# Altium project SOMA_25042022.PrjPcb (part 1 of 2)
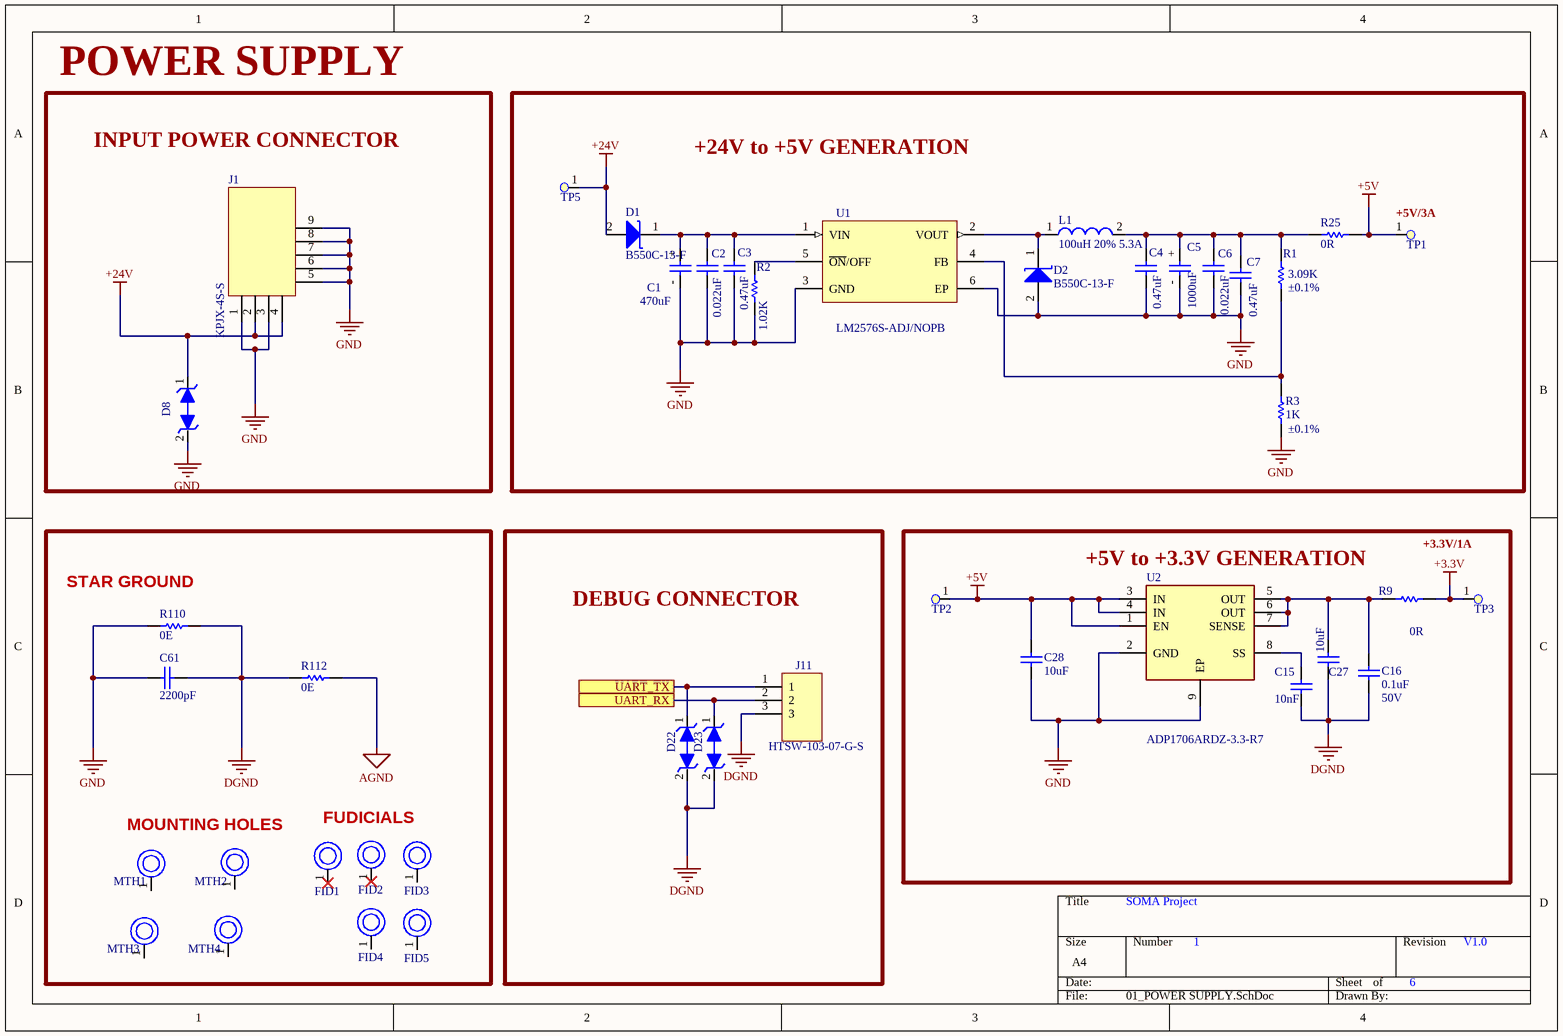
[diagram p0: 01_POWER SUPPLY.SchDoc]
DOC_ID: PRJ/2020/02
6 sheets, 293 parts. Net scope: flat (ports and power ports of the same name join across sheets).
Board file: My_SOMA_25042022.PcbDoc
Sheets:
  01_POWER SUPPLY.SchDoc
  02_SPEAKER & LED STRIPS.SchDoc
  03_CONNECTORS & AUDIO CONTROL INPUTS.SchDoc
  04_BLE & WIFI module.SchDoc
  05_MCU1.SchDoc
  06_ACCELEROMETER.SchDoc

## Sheet 01_POWER SUPPLY.SchDoc: SOMA Project
size A4; Revision: V1.0; SheetNumber: 1

### Parts
C1  value 470uF  [CAPAE1700X1650N]  (hidden comment: CAP ALUM 470UF 20% 63V SMD)
C2  value 0.022uF  [C0603]  (hidden comment: CAP CER 0.022UF 100V X7R 0603)
C3  value 0.47uF  [C1206]  (hidden comment: CAP CER 0.47UF 100V X7R 1206)
C4  value 0.47uF  [C1206]  (hidden comment: CAP CER 0.47UF 100V X7R 1206)
C5  value 1000uF  [CAPAE1300X1350N]  (hidden comment: CAP ALUM 1000UF 20% 25V SMD)
C6  value 0.022uF  [C0603]  (hidden comment: CAP CER 0.022UF 100V X7R 0603)
C7  value 0.47uF  [C1206]  (hidden comment: CAP CER 0.47UF 100V X7R 1206)
C15  value 10nF  [C0603]  (hidden comment: CAP CER 0603 10NF 25VDC X8G)
C16  Rating: 50V  [C0402]  (hidden comment: 0.1uF)
C27  value 10uF  [C0603]  (hidden comment: CAP CER 10UF 25V X5R 0603)
C28  value 10uF  [C0603]  (hidden comment: CAP CER 10UF 25V X5R 0603)
C61  value 2200pF  [C1206]  (hidden comment: CAP CER 2200PF 1.5KV X7R 1206)
D1  DIODE SCHOTTKY 50V 5A SMC  [SOD8060X250N_2A]  (value not drawn)
D2  DIODE SCHOTTKY 50V 5A SMC  [SOD8060X250N_2A]  (value not drawn)
D8  TVS DIODE 24VWM 38.9VC SMC  [SOD8060X260N_BI]  (value not drawn)
D22  TVS DIODE 3.3VWM 11.5VC SOD923  [SOD1006X40N_BI]  (value not drawn)
D23  TVS DIODE 3.3VWM 11.5VC SOD923  [SOD1006X40N_BI]  (value not drawn)
FID1  M3  [FIDUCIAL_40C]  (value not drawn)
FID2  M3  [FIDUCIAL_40C]  (value not drawn)
FID3  M3  [FIDUCIAL_40C]  (value not drawn)
FID4  M3  [FIDUCIAL_40C]  (value not drawn)
FID5  M3  [FIDUCIAL_40C]  (value not drawn)
J1  value KPJX-4S-S  [KYCON_KPJX-4S -S]  (hidden comment: CONN JACK FMALE 4POS TIN SOLDER)
J11  value HTSW-103-07-G-S  [BERG_1X3]  (hidden comment: CONN HEADER VERT 3POS 2.54MM)
L1  value 100uH 20% 5.3A  [IND_MGV1707101M-10]  (hidden comment: FIXED IND 100UH 5.3A 118MOHM SMD)
MTH1  M3  [MH]  (value not drawn)
MTH2  M3  [MH]  (value not drawn)
MTH3  M3  [MH]  (value not drawn)
MTH4  M3  [MH]  (value not drawn)
R1  value 3.09K  Tolerance: ±0.1%  [R1206]  (hidden comment: RES SMD 3.09K OHM 0.1% 1/4W 1206)
R2  value 1.02K  [R1206]  (hidden comment: RES SMD 1.02K OHM 1% 1/4W 1206)
R3  value 1K  Tolerance: ±0.1%  [R0805]  (hidden comment: RES 1K OHM 0.1% 1/8W 0805)
R9  value 0R  [R1206]  (hidden comment: RES 0 OHM JUMPER 1/4W 1206)
R25  value 0R  [R1206]  (hidden comment: RES 0 OHM JUMPER 1/4W 1206)
R110  0E  [R0603]
R112  0E  [R0603]
TP1  Test Point,1.6mm Diameter,SMD  [TP_63C]  (value not drawn)  (no BOM)
TP2  Test Point,1.6mm Diameter,SMD  [TP_63C]  (value not drawn)  (no BOM)
TP3  Test Point,1.6mm Diameter,SMD  [TP_63C]  (value not drawn)  (no BOM)
TP5  Test Point,1.6mm Diameter,SMD  [TP_63C]  (value not drawn)  (no BOM)
U1  value LM2576S-ADJ/NOPB  [TO-263-6_LM2576S]  (hidden comment: IC REG BUCK ADJ 3A TO263-5)
U2  Manufacturer part Number: ADP1706ARDZ-3.3-R7  [SOIC127P600X170-9N]  (hidden comment: IC REG LINEAR 3.3V 1A 8SOIC)

### Blocks framed on the sheet
POWER SUPPLY: D8 J1
+24V to +5V GENERATION: C1-C7 D1 D2 L1 R1-R3 R25 TP1 TP5 U1
DEBUG CONNECTOR: D22 D23 J11
+5V to +3.3V GENERATION: C15 C16 C27 C28 R9 TP2 TP3 U2

### Ports
UART_RX, UART_TX

### Nets
+3.3V: R9.2 TP3.1
+5V: C28.2 R25.2 TP1.1 TP2.1 U2.1(EN) U2.3(IN) U2.4(IN)
+24V: D1.2(A) D8.1(K) J1.2 J1.4 TP5.1
AGND: R112.2
DGND: C15.1 C16.1 C27.1 C61.2 D22.2(A) D23.2(A) J11.3 R110.2 R112.1
GND: C1.- C2.2 C3.1 C4.1 C5.- C6.1 C7.2 C28.1 C61.1 D2.2(A) D8.2(A) J1.1 J1.3 J1.5 J1.6 J1.7 J1.8 J1.9 R2.1 R3.1 R110.1 U1.3(GND) U1.6(EP) U2.2(GND) U2.9(EP)
UART_RX: D23.1(K) J11.2 ; port UART_RX
UART_TX: D22.1(K) J11.1 ; port UART_TX
NetC1_+: C1.+ C2.1 C3.2 D1.1(K) U1.1(VIN)
NetC4_2: C4.2 C5.+ C6.2 C7.1 L1.2 R1.2 R25.1
NetC15_2: C15.2 U2.8(SS)
NetC16_2: C16.2 C27.2 R9.1 U2.5(OUT) U2.6(OUT) U2.7(SENSE)
NetD2_1: D2.1(K) L1.1 U1.2(VOUT)
NetR1_1: R1.1 R3.2 U1.4(FB)
NetR2_2: R2.2 U1.5(~{ON}/OFF)

Not connected (* = marked no-connect by the designer): FID1 1*; FID2 1*; FID3 1; FID4 1; FID5 1; MTH1 1; MTH2 1; MTH3 1; MTH4 1

### Notes on the sheet
- INPUT POWER CONNECTOR
- (near TP1) +5V/3A
- +3.3V/1A
- (near R110) STAR GROUND
- MOUNTING HOLES
- FUDICIALS
- SOMA Project
- 1
- 6
- V1.0

### Library data of the parts
C1 = 470uF: Manufacturer: Panasonic Electronic Components; Manufacturer part Number: EEV-TG1J471M; Operating Temperature: -40°C ~ 125°C; Type: CAP; Package: Radial, Can - SMD; Reference link: https://www.digikey.com/en/products/detail/panasonic-electronic-components/EEV-TG1J471M/615967; Distributor: Digikey; Distributor part Number: PCE3667CT-ND; Unit Price: $2.49000; Tolerance: ±20%; Rating: 63V; Part Status: Active; Size / Dimension: 0.630" Dia (16.00mm)
C2 C6 = CAP CER 0.022UF 100V X7R 0603: Manufacturer: TDK Corporation; Manufacturer part Number: C1608X7R2A223K080AA; Tolerance: ±10%; Operating Temperature: -55°C ~ 125°C; Type: CAP; Package: 0603 (1608 Metric); Reference link: https://www.digikey.com/en/products/detail/tdk-corporation/C1608X7R2A223K080AA/789669; Distributor: Digikey; Distributor part Number: 445-2275-2-ND; Rating: 100V; Part Status: Active; Unit Price: $0.10000
C3 C4 C7 = CAP CER 0.47UF 100V X7R 1206: Manufacturer: TDK Corporation; Manufacturer part Number: C3216X7R2A474K160AE; Tolerance: ±10%; Operating Temperature: -55°C ~ 125°C; Type: CAP; Package: 1206 (3216 Metric); Reference link: https://www.digikey.com/en/products/detail/tdk-corporation/C3216X7R2A474K160AE/3283646; Distributor: Digikey; Distributor part Number: 445-8902-1-ND; Unit Price: $0.73000; Rating: 100V; Part Status: Active
C5 = CAP ALUM 1000UF 20% 25V SMD: Manufacturer: United Chemi-Con; Manufacturer part Number: EMVA250ARA102MKE0S; Prt Status: Active; Operating Temperature: -55°C ~ 105°C; Type: CAP; Package: 512" L x 0.512" W (13.00mm x 13.00mm); Reference link: https://www.digikey.be/product-detail/en/united-chemi-con/EMVA250ARA102MKE0S/565-2110-2-ND/756757; Distributor: Digikey; Distributor part Number: 565-2110-2-ND; Unit Price: 1.25$; Tolerance: 20%; Rating: 1000UF 20% 25V
C15 = CAP CER 0603 10NF 25VDC X8G: Manufacturer: KEMET; Manufacturer part Number: C0603C103K3TACAUTO; Tolerance: ±10%; Rating: 25V; Distributor: Digikey; Package: 0603 (1608 Metric); Type: CAP; Operating Temperature: -55°C ~ 150°C; Distributor part Number: C0603C103K3TACAUTO; Reference link: https://www.digikey.com/en/products/detail/kemet/C0603C103K3TACAUTO/13546784?s=N4IgjCBcpgLFoDGUBmBDANgZwKYBoQB7KAbXAFYBOAJlgHYQBdAgBwBcoQBlNgJwEsAdgHMQAXwJgAbAhDJI6bPiKkQAZhqwZzEO048BI8QSmVZ8xbgLFIZWAAZKsaU1YdI3PkNETwlABxm0HKomFYqtiD2rrrunoY%2BBNT2sEFIoUrWqmD2AASCAGIxeh4AqoL8bADyKACyOGhYAK68OMYgALTU5lB8Tco2ZORMvh1qPZB9A9nRjGK%2B3ZE5hSNAA; Unit Price: $0.45000
C16 = CAP CER 0.1UF 50V X7R 0402: Manufacturer: AVX; Manufacturer part Number: 04025C104KAT2A; Tolerance: ±10%; Operating Temperature: -55°C ~ 125°C; Value: 0.1uF; Package: 0402; Distributor: Mouser; Reference link: https://www.mouser.in/ProductDetail/AVX/04025C104KAT2A?qs=%2Fha2pyFaduhvAwOoQhW9hDDlPxePcbvdgYQJEdBTMGpxgpoTOSNvPA%3D%3D; Distributor part Number: 581-04025C104KAT2A; Type: CAP; Unit Price: ₹7.47
C27 C28 = CAP CER 10UF 25V X5R 0603: Manufacturer: Murata Electronics; Manufacturer part Number: ZRB18AR61E106ME01L; Tolerance: ±20%; Distributor: Digikey; Package: 0603 (1608 Metric); Type: CAP; Operating Temperature: -55°C ~ 85°C; Distributor part Number: 490-10991-1-ND; Reference link: https://www.digikey.com/en/products/detail/murata-electronics/ZRB18AR61E106ME01L/5321083; Unit Price: $0.50000; Rating: 25V
C61 = CAP CER 2200PF 1.5KV X7R 1206: Manufacturer: AVX Corporation; Manufacturer part Number: 1206SC222KAT2A; Tolerance: ±10%; Rating: 1500V; Operating Temperature: -55°C ~ 125°C; Type: CAP; Package: 1206 (3216 Metric); Reference link: https://www.digikey.com/en/products/detail/avx-corporation/1206SC222KAT2A/7536088; Distributor: Digikey; Distributor part Number: 478-10699-1-ND - Cut Tape (CT); Part Status: Active; Unit Price: $0.78000
D1 D2 = B550C-13-F: Manufacturer: Diodes Incorporated; Value: 50V/5A SCHOTTKY; Rating: 50V,5A; Operating Temperature: -55°C ~ 150°C; Package: DO-214AB, SMC; Distributor: Digi-key; Type: Diode; Manufacturer part Number: B550C-13-F; Reference link: https://www.digikey.com/en/products/detail/diodes-incorporated/B550C-13-F/768772?s=N4IgTCBcDaIEIFYEAYDCBaAjAZnQMQAIQBdAXyA; Distributor part Number: B550C-FDICT-ND; Unit Price: $0.58000; Part Status: Active
D8 = TVS DIODE 24VWM 38.9VC SMC: 38.9V Clamp 77.2A Ipp Tvs Diode Surface Mount DO-214AB (SMC); Manufacturer: Bourns Inc.; Manufacturer part Number: SMLJ24CA-Q; Rating: 3000W (3kW); Tolerance: NA; Operating Temperature: -55°C ~ 150°C (TJ); Value: 38.9V Clamp 77.2A; Package: DO-214AB, SMC; Distributor: Digikey; Type: TVS; Reference link: https://www.digikey.com/en/products/detail/bourns-inc/SMLJ24CA-Q/8275811; Distributor part Number: SMLJ24CA-QCT-ND; Unit Price: $1.45000
D22 D23 = TVS DIODE 3.3VWM 11.5VC SOD923: 11.5V Clamp 2A (8/20µs) Ipp Tvs Diode Surface Mount SOD-923; Manufacturer Part Number: ESD9B3.3ST5G; Manufacturer: ON Semiconductor; Value: 3.3V 11.5V; Assembly Option: DNP; Tolerance: NA; Operating Temperature: -55°C to +150°C; Distributor: Digikey; Distributor part Number: ESD9B3.3ST5GOSTR-ND; Package: SOD-923; Rating: 3.3V 11.5V; Reference link: https://www.digikey.com/product-detail/en/on-semiconductor/ESD9B3.3ST5G/ESD9B3.3ST5GOSTR-ND/1973669; Type: TVS; Unit Price: $0.24000
FID1-FID5 MTH1-MTH4 = Fiducial: Part Category: Screw; Discription: MACHINE SCREW PAN  M3; Loading: P; Internal Part no: *; Value: M3; MFR: *; Vendor id: *; MFR Part no: *; Vendor: *; Operating temp: *; ROHS: *
J1 = CONN JACK FMALE 4POS TIN SOLDER: 4 (Power) Position Circular Connector Jack, Female Sockets Solder; Manufacturer: Kycon, Inc.; Rating: 7.5A, 48VDC, UL94 V-0; Manufacturer Part Number: KPJX-4S-S; Package: Tray; Part Status: Active; Connector Type: Jack, Female Sockets; Mounting Type: Through Hole, Right Angle; Operating Temperature: -40°C ~ 75°C; ComponentLink1Description: Datasheet; ComponentLink1URL: https://www.digikey.com/en/products/detail/kycon-inc/KPJX-4S-S/9990088; Distributor: Digikey; Distributor Part Number: 2092-KPJX-4S-S-ND; Type: Through Hole, Right Angle; Assembly Option: *; Unit Price: $2.41000; Tolerance: *; Reference Link: https://www.digikey.com/en/products/detail/kycon-inc/KPJX-4S-S/9990088?s=N4IgTCBcDaINIAUBSANAtAFgMpqyAugL5A
J11 = CONN HEADER VERT 3POS 2.54MM: Connector Header Through Hole 3 position 0.100" (2.54mm); Manufacturer: Samtec Inc.; Rating: UL94 V-0; Tolerance: NA; Unit Price: $0.55000; Distributor: Digikey; Distributor part Number: SAM8814-ND; Manufacturer part Number: HTSW-103-07-G-S; Package: Bag; Reference link: https://www.digikey.com/en/products/detail/samtec-inc/HTSW-103-07-G-S/2345285; Type: Header, Male Pin, Through hole
L1 = FIXED IND 100UH 5.3A 118MOHM SMD: Manufacturer: Laird-Signal Integrity Products; Manufacturer part Number: MGV1707101M-10; Tolerance: ±20%; Distributor: Digikey; Distributor part Number: 240-3213-1-ND; Reference link: https://www.digikey.com/en/products/detail/laird-signal-integrity-products/MGV1707101M-10/9558761; Package: Nonstandard; Operating Temperature: -55°C ~ 125°C; Type: IND; Unit Price: $5.72000; Size / Dimension: 0.693" L x 0.665" W (17.60mm x 16.90mm); Part Status: Active
R1 = RES SMD 3.09K OHM 0.1% 1/4W 1206: Manufacturer: Panasonic; Manufacturer part Number: ERA-8AEB3091V; Distributor: Digikey; Distributor part Number: P3.09KBCCT-ND; Unit Price: $0.57000; Reference link: https://www.digikey.com/en/products/detail/panasonic-electronic-components/ERA-8AEB3091V/3070954; Type: RES; Package: 1206 (3216 Metric); Part Status: Active; Operating Temperature: -55°C ~ 155°C; Size / Dimension: 0.122" L x 0.063" W (3.10mm x 1.60mm)
R2 = RES SMD 1.02K OHM 1% 1/4W 1206: Manufacturer: Vishay Dale; Manufacturer part Number: CRCW12061K02FKEA; Distributor: Digikey; Distributor part Number: 541-1.02KFCT-ND; Unit Price: $0.10000; Reference link: https://www.digikey.com/en/products/detail/vishay-dale/CRCW12061K02FKEA/1176645; Type: RES; Rating: AEC-Q200; Package: 1206 (3216 Metric); Tolerance: ±1%; Part Status: Active; Operating Temperature: -55°C ~ 155°C
R3 = RES 1K OHM 0.1% 1/8W 0805: Manufacturer: Panasonic; Manufacturer part Number: ERA-6AEB102V; Distributor: Digikey; Distributor part Number: P1.0KDACT-ND; Unit Price: $0.310000; Reference link: https://www.digikey.com/en/products/detail/panasonic-electronic-components/ERA-6AEB102V/1465748; Type: RES; Rating: 1/8W; Package: 0805 (2012 Metric); Part Status: Active; Operating Temperature: -55°C ~ 155°C; Size / Dimension: 0.039" L x 0.020" W (1.00mm x 0.50mm)
R9 R25 = RES 0 OHM JUMPER 1/4W 1206: Manufacturer: Yageo; Manufacturer part Number: RC1206JR-100RL; Distributor: Digikey; Distributor part Number: 13-RC1206JR-100RLTR-ND; Unit Price: 0.01063; Reference link: https://www.digikey.sg/product-detail/en/yageo/RC1206JR-100RL/13-RC1206JR-100RLTR-ND/13694179; Type: RES; Package: 1206 (3216 Metric); Tolerance: Jumper; Part Status: Active; Operating Temperature: -55°C ~ 155°C; Size / Dimension: 0.122" L x 0.063" W (3.10mm x 1.60mm)
R110 = RES SMD 0 OHM JUMPER 1/10W 0603: Manufacturer part Number: RC0603JR-070RL; Manufacturer: Yageo; Assembly Option: DNP; Operating Temperature: -55°C ~ 155°C; Value: 0E; Distributor: Digikey; Package: 0603; Type: RES; Distributor part Number: 311-0.0GRCT-ND; Reference link: https://www.digikey.com/product-detail/en/yageo/RC0603JR-070RL/311-0.0GRCT-ND/729622; Rating: 1/10W; Cost: 0.00412
R112 = RES SMD 0 OHM JUMPER 1/10W 0603: Manufacturer part Number: RC0603JR-070RL; Manufacturer: Yageo; Operating Temperature: -55°C ~ 155°C; Value: 0E; Distributor: Digikey; Package: 0603; Type: RES; Distributor part Number: 311-0.0GRCT-ND; Reference link: https://www.digikey.com/product-detail/en/yageo/RC0603JR-070RL/311-0.0GRCT-ND/729622; Rating: 1/10W; Cost: 0.00412
U1 = IC REG BUCK ADJ 3A TO263-5: Buck Switching Regulator IC Positive Adjustable 1.23V 1 Output 3A TO-263-6, D²Pak (5 Leads + Tab), TO-263BA; Manufacturer: Texas Instruments; Tolerance: NA; Manufacturer part Number: LM2576S-ADJ/NOPB; Distributor: Digikey; Distributor part Number: LM2576S-ADJ/NOPB-ND; Package: TO-263-6, D²Pak (5 Leads + Tab), TO-263BA; Rating: 1.23V 1 Output 3A; Type: IC; Operating Temperature: -40°C ~ 125°C (TJ); Unit Price: $4.79000; Reference link: https://www.digikey.com/en/products/detail/texas-instruments/LM2576S-ADJ-NOPB/363655
U2 = IC REG LINEAR 3.3V 1A 8SOIC: Linear Voltage Regulator IC Positive Fixed 1 Output 1A 8-SOIC-EP; Manufacturer: Analog Devices Inc.; Tolerance: NA; Value: ADP1706ARDZ-3.3-R7; Rating: 3.3V 1A; Package: 8-SOIC (0.154", 3.90mm Width) Exposed Pad; Operating Temperature: -40°C ~ 125°C; Distributor: Digikey; Distributor part Number: ADP1706ARDZ-3.3-R7CT-ND; Reference link: https://www.digikey.com/en/products/detail/analog-devices-inc/ADP1706ARDZ-3-3-R7/1766873?s=N4IgTCBcDaIIIBEAKBGA7ABgGxwEoIC0BaAZgDoSjc0QBdAXyA; Type: IC; Unit Price: $3.15000
TP1-TP3 TP5 = Test Point,1.6mm Diameter,SMD: AEMCI Part Number: *; Vendor: *; Vendor ID: *

## Sheet 02_SPEAKER & LED STRIPS.SchDoc
size A4
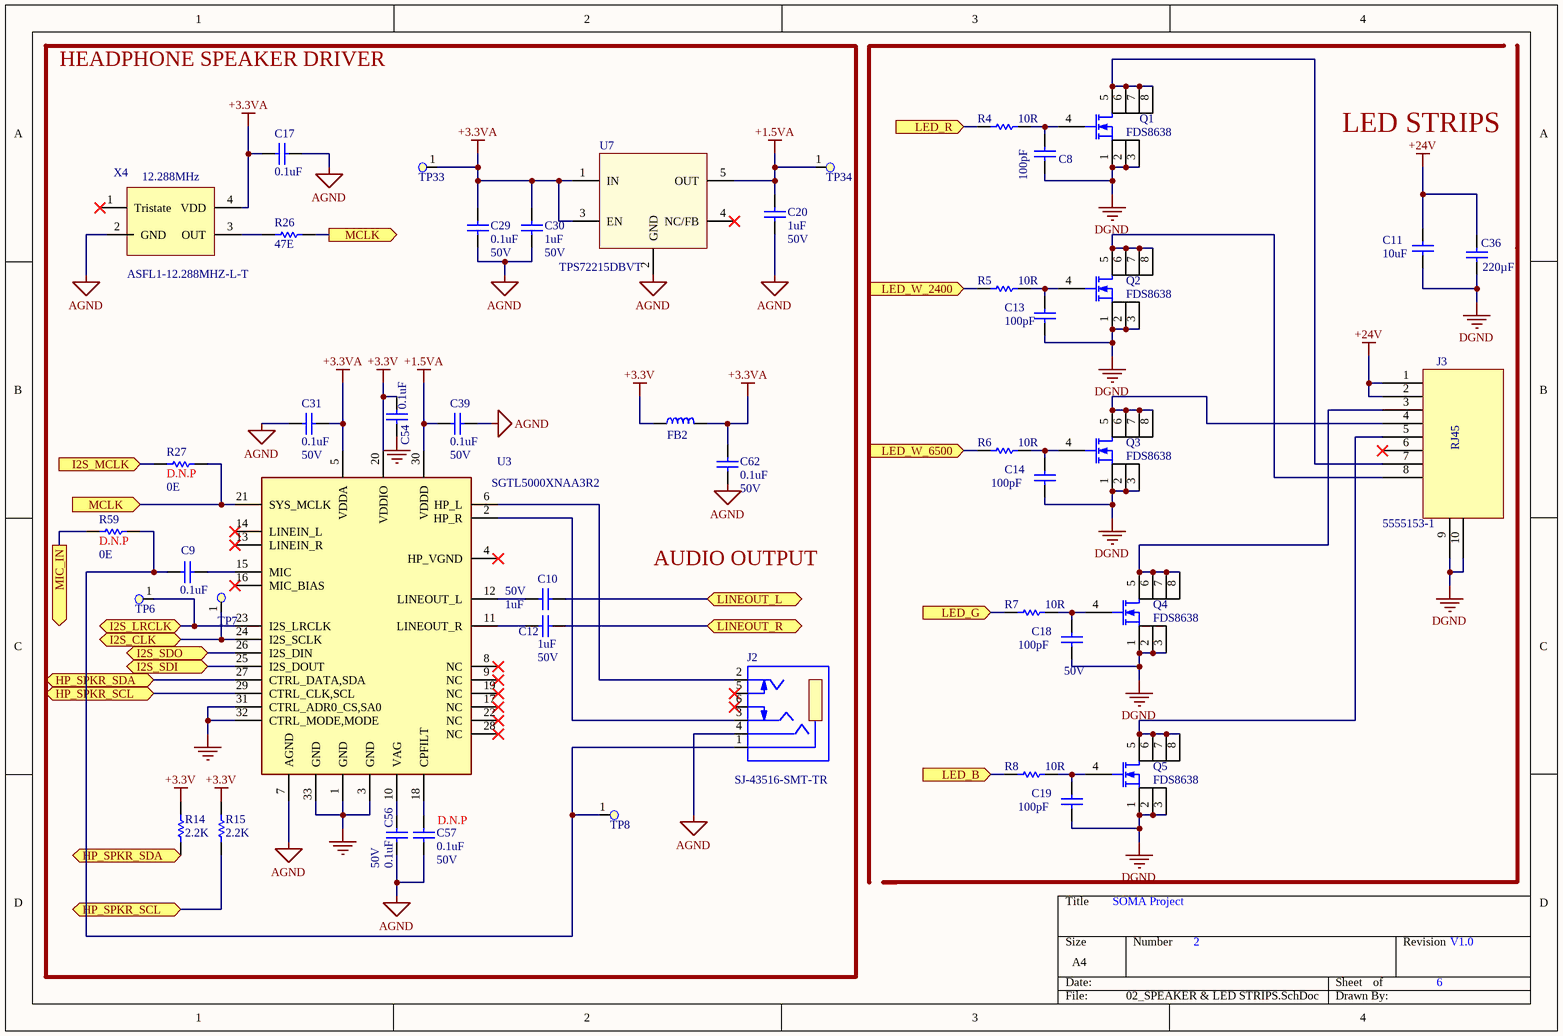
[diagram p1: 02_SPEAKER & LED STRIPS.SchDoc]

### Parts
C8  value 100pF  [C0402]  (hidden comment: CAP CER 100PF 50V C0G/NP0 0402)
C9  0.1uF  [C0603]
C10  value 1uF  Rating: 50V  [C0402]  (hidden comment: CAP CER 1UF 50V X5R 0402)
C11  value 10uF  [C1206]  (hidden comment: CAP CER 10UF 50V X5R 1206)
C12  value 1uF  Rating: 50V  [C0402]  (hidden comment: CAP CER 1UF 50V X5R 0402)
C13  value 100pF  [C0402]  (hidden comment: CAP CER 100PF 50V C0G/NP0 0402)
C14  value 100pF  [C0402]  (hidden comment: CAP CER 100PF 50V C0G/NP0 0402)
C17  0.1uF  [C0603]
C18  value 100pF  Rating: 50V  [C0402]  (hidden comment: CAP CER 100PF 50V C0G/NP0 0402)
C19  value 100pF  [C0402]  (hidden comment: CAP CER 100PF 50V C0G/NP0 0402)
C20  value 1uF  Rating: 50V  [C0603]  (hidden comment: CAP CER 1UF 50V X5R 0603)
C29  Rating: 50V  [C0402]  (hidden comment: 0.1uF)
C30  value 1uF  Rating: 50V  [C0603]  (hidden comment: CAP CER 1UF 50V X5R 0603)
C31  Rating: 50V  [C0402]  (hidden comment: 0.1uF)
C36  value 220µF  [C1206]  (hidden comment: CAP CER 220UF 4V X5R 1206)
C39  Rating: 50V  [C0402]  (hidden comment: 0.1uF)
C54  0.1uF  [C0603]
C56  Rating: 50V  [C0402]  (hidden comment: 0.1uF)
C57  Assembly Option: D.N.P  Rating: 50V  [C0402]  (hidden comment: 0.1uF)
C62  Rating: 50V  [C0402]  (hidden comment: 0.1uF)
FB2  600 Ohms @ 100MHz  [FB0603]  (value not drawn)
J2  Manufacturer part Number: SJ-43516-SMT-TR  [CUI_SJ-43516-SMT-TR]  (hidden comment: CONN JACK 4COND 3.5MM SMD R/A)
J3  value 5555153-1  [TE_55551531]  (hidden comment: CONN MOD JACK 8P8C R/A SHIELDED)
Q1  value FDS8638  [SOIC127P600X175-8N]  (hidden comment: MOSFET N-CH 40V 18A 8SOIC)
Q2  value FDS8638  [SOIC127P600X175-8N]  (hidden comment: MOSFET N-CH 40V 18A 8SOIC)
Q3  value FDS8638  [SOIC127P600X175-8N]  (hidden comment: MOSFET N-CH 40V 18A 8SOIC)
Q4  value FDS8638  [SOIC127P600X175-8N]  (hidden comment: MOSFET N-CH 40V 18A 8SOIC)
Q5  value FDS8638  [SOIC127P600X175-8N]  (hidden comment: MOSFET N-CH 40V 18A 8SOIC)
R4  value 10R  [R0402]  (hidden comment: RES SMD 10 OHM 5% 1/16W 0402)
R5  value 10R  [R0402]  (hidden comment: RES SMD 10 OHM 5% 1/16W 0402)
R6  value 10R  [R0402]  (hidden comment: RES SMD 10 OHM 5% 1/16W 0402)
R7  value 10R  [R0402]  (hidden comment: RES SMD 10 OHM 5% 1/16W 0402)
R8  value 10R  [R0402]  (hidden comment: RES SMD 10 OHM 5% 1/16W 0402)
R14  value 2.2K  [R0402]  (hidden comment: RES 2.2K OHM 1% 1/16W 0402)
R15  value 2.2K  [R0402]  (hidden comment: RES 2.2K OHM 1% 1/16W 0402)
R26  value 47E  [R0402]  (hidden comment: RES SMD 47 OHM 5% 1/10W 0402)
R27  Assembly Option: D.N.P  [R0603]  (hidden comment: 0E)
R59  Assembly Option: D.N.P  [R0603]  (hidden comment: 0E)
TP6  Test Point,1.6mm Diameter,SMD  [TP_63C]  (value not drawn)  (no BOM)
TP7  Test Point,1.6mm Diameter,SMD  [TP_63C]  (value not drawn)  (no BOM)
TP8  Test Point,1.6mm Diameter,SMD  [TP_63C]  (value not drawn)  (no BOM)
TP33  Test Point,1.6mm Diameter,SMD  [TP_63C]  (value not drawn)  (no BOM)
TP34  Test Point,1.6mm Diameter,SMD  [TP_63C]  (value not drawn)  (no BOM)
U3  value SGTL5000XNAA3R2  [QFN50P500X500X100-33N]  (hidden comment: IC AUDIO CODEC STEREO 32-QFN)
U7  TPS72215DBVT  [SOT95P280X145-5N]
X4  value 12.288MHz  Manufacturer part Number: ASFL1-12.288MHZ-L-T  [XTAL500X320X130-4N]  (hidden comment: XTAL OSC XO 12.2880MHZ HCMOS TTL)

### Ports
HP_SPKR_SCL (bidir), HP_SPKR_SDA (bidir), I2S_CLK (bidir), I2S_LRCLK (bidir), I2S_MCLK (in), I2S_SDI (bidir), I2S_SDO (bidir), LED_B (in), LED_G (in), LED_R (in), LED_W_2400 (in), LED_W_6500 (in), LINEOUT_L (bidir), LINEOUT_R (bidir), MCLK (in), MCLK (out), MIC_IN (out)

### Nets
+1.5VA: C20.2 C39.2 TP34.1 U3.30(VDDD) U7.5(OUT)
+3.3V: C54.1 FB2.2 R14.2 R15.2 U3.20(VDDIO)
+3.3VA: C17.2 C29.1 C30.2 C31.1 C62.2 FB2.1 TP33.1 U3.5(VDDA) U7.1(IN) U7.3(EN) X4.4(VDD)
+24V: C11.2 C36.2 J3.1 J3.2
AGND: C17.1 C20.1 C29.2 C30.1 C31.2 C39.1 C56.1 C57.1 C62.1 J2.4(RING2) U3.7(AGND) U7.2(GND) X4.2(GND)
DGND: C8.1 C11.1 C13.1 C14.1 C18.1 C19.1 C36.1 J3.9 J3.10 Q1.1 Q1.2 Q1.3 Q2.1 Q2.2 Q2.3 Q3.1 Q3.2 Q3.3 Q4.1 Q4.2 Q4.3 Q5.1 Q5.2 Q5.3
GND: C54.2 U3.1(GND) U3.3(GND) U3.31(CTRL_ADR0_CS,SA0) U3.32(CTRL_MODE,MODE) U3.33(GND)
HP_SPKR_SCL: R15.1 U3.29(CTRL_CLK,SCL) ; port HP_SPKR_SCL
HP_SPKR_SDA: R14.1 U3.27(CTRL_DATA,SDA) ; port HP_SPKR_SDA
I2S_CLK: TP7.1 U3.24(I2S_SCLK) ; port I2S_CLK
I2S_LRCLK: TP6.1 U3.23(I2S_LRCLK) ; port I2S_LRCLK
I2S_MCLK: R27.2 ; port I2S_MCLK
I2S_SDI: U3.25(I2S_DOUT) ; port I2S_SDI
I2S_SDO: U3.26(I2S_DIN) ; port I2S_SDO
LED_B: R8.1 ; port LED_B
LED_G: R7.1 ; port LED_G
LED_R: R4.1 ; port LED_R
LED_W_2400: R5.1 ; port LED_W_2400
LED_W_6500: R6.1 ; port LED_W_6500
LINEOUT_L: C10.2 ; port LINEOUT_L
LINEOUT_R: C12.2 ; port LINEOUT_R
MCLK: R26.2 R27.1 U3.21(SYS_MCLK) ; port MCLK
MIC_IN: R59.2 ; port MIC_IN
NetC8_2: C8.2 Q1.4 R4.2
NetC9_1: C9.1 U3.15(MIC)
NetC9_2: C9.2 J2.1(SLEEVE) R59.1 TP8.1
NetC10_1: C10.1 U3.12(LINEOUT_L)
NetC12_1: C12.1 U3.11(LINEOUT_R)
NetC13_2: C13.2 Q2.4 R5.2
NetC14_2: C14.2 Q3.4 R6.2
NetC18_2: C18.2 Q4.4 R7.2
NetC19_2: C19.2 Q5.4 R8.2
NetC56_2: C56.2 U3.10(VAG)
NetC57_2: C57.2 U3.18(CPFILT)
NetJ2_2: J2.2(TIP) U3.6(HP_L)
NetJ2_3: J2.3(RING1) U3.2(HP_R)
NetJ3_3: J3.3 Q4.5 Q4.6 Q4.7 Q4.8
NetJ3_4: J3.4 Q3.5 Q3.6 Q3.7 Q3.8
NetJ3_5: J3.5 Q5.5 Q5.6 Q5.7 Q5.8
NetJ3_7: J3.7 Q1.5 Q1.6 Q1.7 Q1.8
NetJ3_8: J3.8 Q2.5 Q2.6 Q2.7 Q2.8
NetR26_1: R26.1 X4.3(OUT)

Not connected (* = marked no-connect by the designer): J2 5(TIP_SWITCH)* 6(RING_SWITCH)*; J3 6*; U3 4(HP_VGND)* 8(NC)* 9(NC)* 13(LINEIN_R)* 14(LINEIN_L)* 16(MIC_BIAS)* 17(NC)* 19(NC)* 22(NC)* 28(NC)*; U7 4(NC/FB)*; X4 1(Tristate)*

### Notes on the sheet
- HEADPHONE SPEAKER DRIVER
- LED STRIPS
- AUDIO OUTPUT
- SOMA Project
- 2
- 6
- V1.0
- (in symbol CONN MOD JACK 8P8C R/A SHIELDED) RJ45

### Library data of the parts
C8 C13 C14 C18 C19 = CAP CER 100PF 50V C0G/NP0 0402: 100 pF ±5% 50V Ceramic Capacitor C0G, NP0 0402 (1005 Metric); Manufacturer: KEMET; Manufacturer part Number: C0402C101J5GACTU; Tolerance: ±5%; Operating Temperature: -55°C ~ 125°C; Package: 0402 (1005 Metric); Distributor: Digikey; Distributor part Number: 399-3194-1-ND; Reference link: https://www.digikey.com/en/products/detail/kemet/C0402C101J5GACTU/569895?s=N4IgTCBcDaIMIAYAsCxwIwPQKQKwHEBBOAFQFUQBdAXyA; Unit Price: $0.10000; Type: CAP
  C8 C13 C14 C19: Rating: 50V
C9 C17 C54 = CAP CER 0.1UF 10V X7R 0603: Manufacturer: Würth Elektronik; Manufacturer part Number: 885012206020; Tolerance: ±10%; Operating Temperature: -55°C ~ 125°C; Reference link: https://www.digikey.com/en/products/detail/w%C3%BCrth-elektronik/885012206020/5453794; Package: 0603 (1608 Metric); Distributor: Digikey; Distributor part Number: 732-7939-1-ND; Type: CAP; Unit Price: $0.10000; Value: 0.1uF; Rating: 10V
C10 C12 = CAP CER 1UF 50V X5R 0402: 1 µF ±10% 50V Ceramic Capacitor X5R 0402 (1005 Metric); Manufacturer: Taiyo Yuden; Manufacturer part Number: UMK105CBJ105KV-F; Tolerance: ±10%; Operating Temperature: -55°C ~ 85°C; Reference link: https://www.digikey.com/en/products/detail/taiyo-yuden/UMK105CBJ105KV-F/7403870; Package: 0402 (1005 Metric); Distributor: Digikey; Distributor part Number: 587-UMK105CBJ105KV-FCT-ND; Type: CAP; Unit Price: $0.32000
C11 = CAP CER 10UF 50V X5R 1206: 10µF ±20% 50V Ceramic Capacitor X5R 1206 (3216 Metric); Manufacturer: Samsung Electro-Mechanics; Manufacturer part Number: CL31A106MBHNNNE; Tolerance: ±20%; Operating Temperature: -55°C ~ 85°C; Type: CAP; Package: 1206 (3216 Metric); Reference link: https://www.digikey.in/product-detail/en/samsung-electro-mechanics/CL31A106MBHNNNE/1276-6736-2-ND/5961220; Distributor: Digikey; Distributor part Number: 1276-6736-2-ND; Unit Price: 5.29660; Rating: 50V; Part Status: Active
C20 C30 = CAP CER 1UF 50V X5R 0603: Manufacturer: Taiyo Yuden; Manufacturer part Number: UMK107BJ105KA-T; Tolerance: ±10%; Operating Temperature: -55°C ~ 125°C; Reference link: https://www.digikey.in/product-detail/en/taiyo-yuden/UMK107BJ105KA-T/587-2400-2-ND/2178919; Package: 0603; Distributor: Digikey; Distributor part Number: 587-2400-2-ND; Type: CAP; Unit Price: 2.57370
C29 C31 C39 C56 C57 C62 = CAP CER 0.1UF 50V X7R 0402: as C16 on sheet 01_POWER SUPPLY; Operating Temperature: -55°C ~ 125°C; Value: 0.1uF; Package: 0402; Distributor: Mouser; Reference link: https://www.mouser.in/ProductDetail/AVX/04025C104KAT2A?qs=%2Fha2pyFaduhvAwOoQhW9hDDlPxePcbvdgYQJEdBTMGpxgpoTOSNvPA%3D%3D; Distributor part Number: 581-04025C104KAT2A; Type: CAP; Unit Price: ₹7.47
C36 = CAP CER 220UF 4V X5R 1206: 220µF ±20% 4V Ceramic Capacitor X5R 1206 (3216 Metric); Manufacturer: Murata Electronics; Manufacturer part Number: GRM31CR60G227ME11L; Distributor: Digikey; Package: 1206 (3216 Metric); Type: CAP; Operating Temperature: -55°C ~ 85°C; Distributor part Number: 490-9774-2-ND; Reference link: https://www.digikey.in/product-detail/en/murata-electronics/GRM31CR60G227ME11L/490-9774-2-ND/4969458; Tolerance: ±20%; Unit Price: 34.53501; Rating: 4V
FB2 = FERRITE BEAD 600 OHM 0603 1LN: Manufacturer: Murata; Manufacturer part Number: BLM18AG601SN1D; Type: FB; Assembly Option: DNP; Value: 600 Ohms @ 100MHz; Distributor: Digikey; Package: 0603; Operating Temperature: -55°C ~ 125°C; Rating: 600 Ohms @ 100MHz; Distributor part Number: 490-1014-2-ND; Reference link: https://www.digikey.com/product-detail/en/murata-electronics-north-america/BLM18AG601SN1D/490-1014-2-ND/584225; Unit Price: $0.02306
J2 = CONN JACK 4COND 3.5MM SMD R/A: 3.50mm (0.141", 1/8", Mini Plug) - Headphone Phone Jack Stereo (4 Conductor, TRRS) Connector Solder; Manufacturer: CUI Devices; Rating: 12VDC; Tolerance: NA; Value: SJ-43516-SMT-TR; Operating Temperature: -20°C ~ 85°C; Unit Price: $1.10000; Distributor: Digikey; Distributor part Number: CP-43516SJCT-ND; Package: Cut Tape (CT); Reference link: https://www.digikey.com/en/products/detail/cui-devices/SJ-43516-SMT-TR/669721; Type: Phone Jack,Surface Mount, Right Angle
J3 = CONN MOD JACK 8P8C R/A SHIELDED: Jack Modular Connector 8p8c (RJ45, Ethernet) 90° Angle (Right) Shielded Cat3; Manufacturer: TE Connectivity AMP Connectors; Tolerance: NA; Unit Price: $2.11000; Distributor: Digikey; Distributor part Number: A31438-ND; Manufacturer part Number: 5555153-1; Package: Tray; Rating: Cat3; Reference link: https://www.digikey.com/en/products/detail/te-connectivity-amp-connectors/5555153-1/769582?s=N4IgTCBcDaIKwLgRjgZgLRJAXQL5A; Type: Modular Connectors - Jacks, Through hole; Operating Temperature: -40°C ~ 85°C
Q1-Q5 = MOSFET N-CH 40V 18A 8SOIC: N-Channel 40 V 18A (Ta) 2.5W (Ta) Surface Mount 8-SOIC; Manufacturer: ON Semiconductor; Rating: 40 V 18A 2.5W; Tolerance: NA; Type: Transistors - FETs, MOSFETs - Single, N-Channel; Unit Price: $2.12000; Distributor: Digikey; Distributor part Number: FDS8638CT-ND; Manufacturer part Number: FDS8638; Package: 8-SOIC (0.154", 3.90mm Width); Reference link: https://www.digikey.com/en/products/detail/on-semiconductor/FDS8638/2051638?s=N4IgTCBcDaIGIBEDKAOAbAZhSAugXyA
R4-R8 = RES SMD 10 OHM 5% 1/16W 0402: 10 Ohms ±5% 0.063W, 1/16W Chip Resistor 0402 (1005 Metric) Automotive AEC-Q200 Thick Film; Manufacturer: Vishay Dale; Manufacturer part Number: CRCW040210R0JNED; Rating: AEC-Q200  0.063W, 1/16W; Tolerance: ±5%; Distributor: Digikey; Package: 0402 (1005 Metric); Operating Temperature: -55°C ~ 155°C; Type: RES; Distributor part Number: 541-10JCT-ND; Reference link: https://www.digikey.com/en/products/detail/vishay-dale/CRCW040210R0JNED/1177520; Unit Price: $0.10000
R14 R15 = RES SMD 10 OHM 5% 1/16W 0402: 2.2 kOhms ±1% 0.063W, 1/16W Chip Resistor 0402 (1005 Metric) Moisture Resistant Thick Film; Manufacturer: YAGEO; Manufacturer part Number: RC0402FR-072K2L; Tolerance: ±1%; Distributor: Digikey; Package: 0402 (1005 Metric); Operating Temperature: -55°C ~ 155°C; Type: RES; Distributor part Number: 311-2.20KLRTR-ND; Reference link: https://www.digikey.com/en/products/detail/yageo/RC0402FR-072K2L/726553; Rating: 0.063W, 1/16W; Unit Price: $0.10000
R26 = RES SMD 47 OHM 5% 1/10W 0402: Manufacturer: Panasonic; Manufacturer part Number: ERJ-2GEJ470X; Distributor: Digikey; Distributor part Number: P47JTR-ND; Reference link: https://www.digikey.com/product-detail/en/panasonic-electronic-components/ERJ-2GEJ470X/P47JTR-ND/147020; Package: 0402; Rating: 1/10W; Operating Temperature: -55°C ~ 155°C; Type: RES; Tolerance: ±5%; Unit Price: $0.00395
R27 R59 = RES SMD 0 OHM JUMPER 1/10W 0603: as R112 on sheet 01_POWER SUPPLY; Operating Temperature: -55°C ~ 155°C; Distributor: Digikey; Package: 0603; Type: RES; Distributor part Number: 311-0.0GRCT-ND; Reference link: https://www.digikey.com/product-detail/en/yageo/RC0603JR-070RL/311-0.0GRCT-ND/729622; Rating: 1/10W; Value: 0E; Unit Price: $0.10000
U3 = IC AUDIO CODEC STEREO 32-QFN: Stereo Audio Interface - I²C, Serial, SPI™ 32-QFN-EP (5x5); Manufacturer: NXP USA Inc.; Tolerance: NA; Rating: 1.1V ~ 2V, 1.62V ~ 3.6V; Manufacturer part Number: SGTL5000XNAA3R2; Operating Temperature: -40°C ~ 85°C; Distributor: Digikey; Distributor part Number: SGTL5000XNAA3R2CT-ND; Reference link: https://www.digikey.com/en/products/detail/nxp-usa-inc/SGTL5000XNAA3R2/2186898; Package: 32-VFQFN Exposed Pad; Type: IC; Unit Price: $4.19000
U7 = IC REG LINEAR 1.5V 50MA SOT23-5: Manufacturer: Texas Instruments; Tolerance: NA; Rating: 0.1V@50mA; Distributor part Number: 296-12521-1-ND; Reference link: https://www.digikey.com/en/products/detail/texas-instruments/TPS72215DBVT/432081; Type: IC; Value: TPS72215DBVT; Manufacturer part Number: TPS72215DBVT; Distributor: Digikey; Package: SOT23-5; Operating Temperature: -40°C ~ 125°C; Unit Price: $1.53000
X4 = XTAL OSC XO 12.2880MHZ HCMOS TTL: Manufacturer: Abracon LLC; Rating: 3.3V,100ppm; Distributor: Digikey; Package: 4 SMD, No Lead; Operating Temperature: -40°C ~ 85°C; Type: Crystal; Distributor part Number: 535-10810-1-ND; Reference link: https://www.digikey.com/en/products/detail/abracon-llc/ASFL1-12-288MHZ-L-T/2623937; Unit Price: $1.14000
TP6-TP8 TP33 TP34 = Test Point,1.6mm Diameter,SMD: AEMCI Part Number: *; Vendor: *; Vendor ID: *

## Sheet 03_CONNECTORS & AUDIO CONTROL INPUTS.SchDoc
size A4
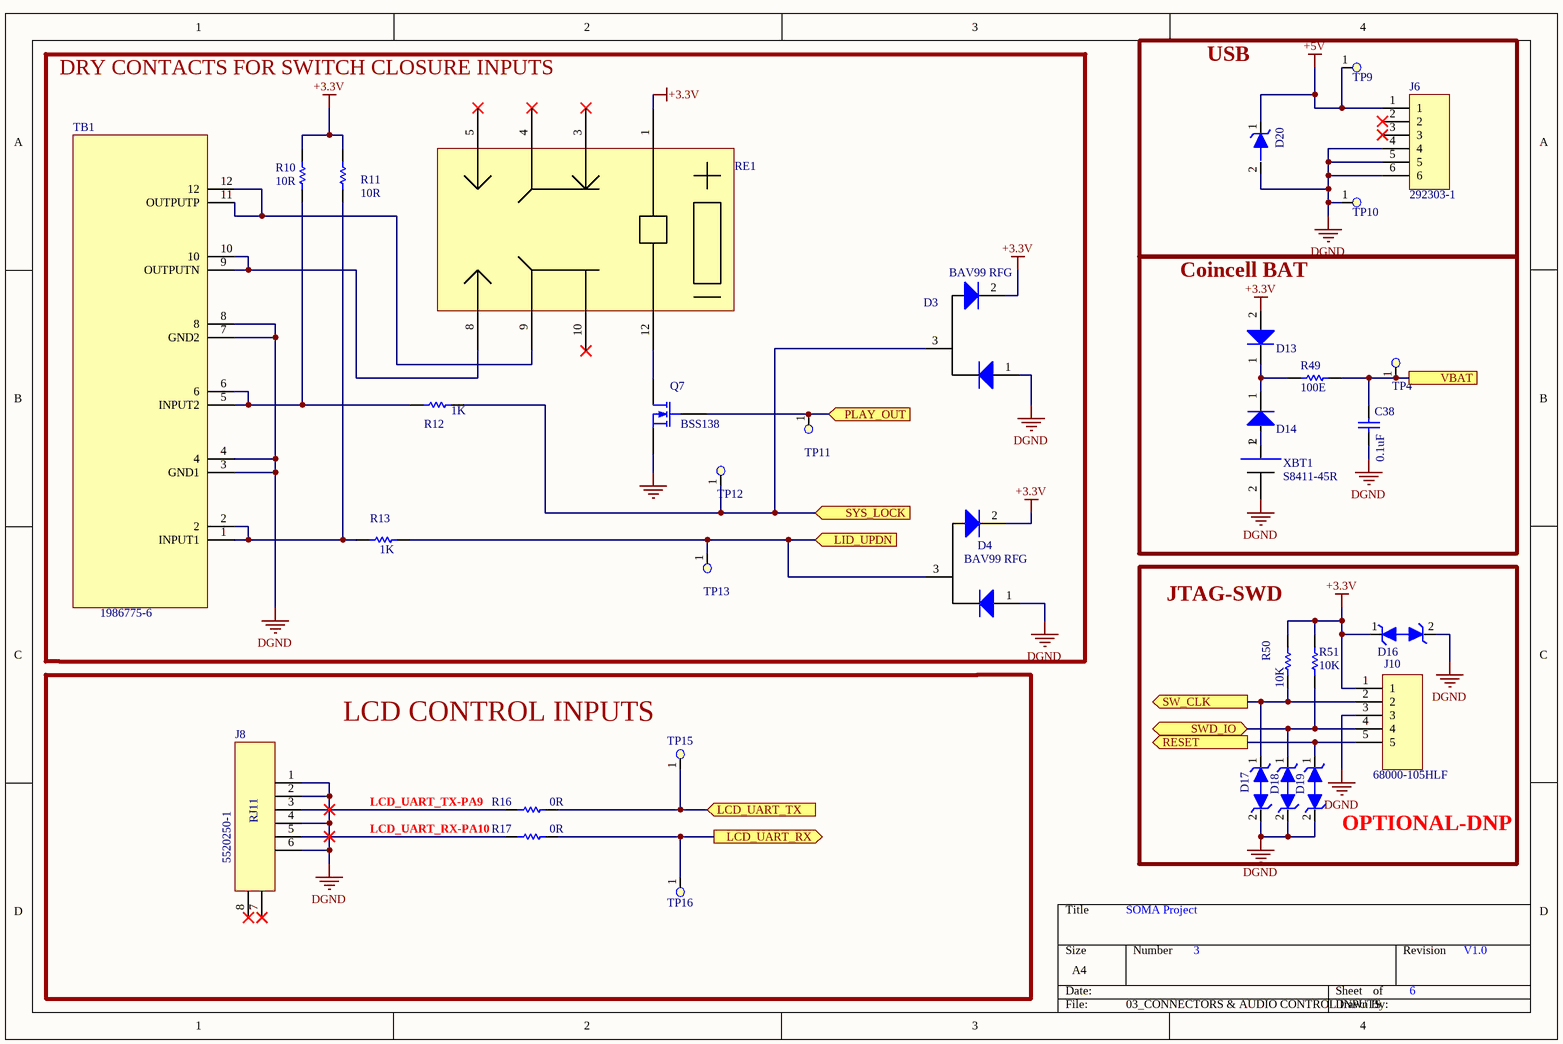
[diagram p2: 03_CONNECTORS & AUDIO CONTROL INPUTS.SchDoc]

### Parts
C38  0.1uF  [C0603]
D3  value BAV99 RFG  [SOT95P240X130-3N]  (hidden comment: DIODE ARRAY GP 70V 200MA SOT23)
D4  value BAV99 RFG  [SOT95P240X130-3N]  (hidden comment: DIODE ARRAY GP 70V 200MA SOT23)
D13  DIODE SCHOTTKY 30V 200MA SOD123  [SOD3715X140N_2A]  (value not drawn)
D14  DIODE SCHOTTKY 30V 200MA SOD123  [SOD3715X140N_2A]  (value not drawn)
D16  TVS DIODE 3.3VWM 11.5VC SOD923  [SOD1006X40N_BI]  (value not drawn)
D17  TVS DIODE 3.3VWM 11.5VC SOD923  [SOD1006X40N_BI]  (value not drawn)
D18  TVS DIODE 3.3VWM 11.5VC SOD923  [SOD1006X40N_BI]  (value not drawn)
D19  TVS DIODE 3.3VWM 11.5VC SOD923  [SOD1006X40N_BI]  (value not drawn)
D20  TVS DIODE 5VWM 12VC SOD723  [SOD1460X65N_2A]  (value not drawn)
J6  value 292303-1  [TE_292303-1]  (hidden comment: CONN RCPT USB2.0 TYPEA 4POS R/A)
J8  Manufacturer Part Number: 5520250-1  [TE_5520250-1]  (hidden comment: CONN MOD JACK 6P2C R/A UNSHLD)
J10  value 68000-105HLF  [BERG_1X5]  (hidden comment: CONN HEADER VERT 5POS 2.54MM)
Q7  value BSS138  [SOT95P240X110-3N]  (hidden comment: MOSFET N-CH 50V 220MA SOT23-3)
R10  value 10R  [R0402]  (hidden comment: RES SMD 10 OHM 5% 1/16W 0402)
R11  value 10R  [R0402]  (hidden comment: RES SMD 10 OHM 5% 1/16W 0402)
R12  value 1K  [R0402]  (hidden comment: RES SMD 1K OHM 1% 1/16W 0402)
R13  value 1K  [R0402]  (hidden comment: RES SMD 1K OHM 1% 1/16W 0402)
R16  value 0R  [R0402]  (hidden comment: RES SMD 0 OHM JUMPER 1/16W 0402)
R17  value 0R  [R0402]  (hidden comment: RES SMD 0 OHM JUMPER 1/16W 0402)
R49  100E  [R0402]
R50  10K  [R0402]
R51  10K  [R0402]
RE1  RELAY GEN PURPOSE DPDT 1A 3VDC  [RELAY_TXS2SA-3V]  (value not drawn)
TB1  Manufacturer Part Number: 1986775-6  [TE_1986775-6]  (hidden comment: TERM BLK 6P SIDE ENT 5.08MM PCB)
TP4  Test Point,1.6mm Diameter,SMD  [TP_63C]  (value not drawn)  (no BOM)
TP9  Test Point,1.6mm Diameter,SMD  [TP_63C]  (value not drawn)  (no BOM)
TP10  Test Point,1.6mm Diameter,SMD  [TP_63C]  (value not drawn)  (no BOM)
TP11  Test Point,1.6mm Diameter,SMD  [TP_63C]  (value not drawn)  (no BOM)
TP12  Test Point,1.6mm Diameter,SMD  [TP_63C]  (value not drawn)  (no BOM)
TP13  Test Point,1.6mm Diameter,SMD  [TP_63C]  (value not drawn)  (no BOM)
TP15  Test Point,1.6mm Diameter,SMD  [TP_63C]  (value not drawn)  (no BOM)
TP16  Test Point,1.6mm Diameter,SMD  [TP_63C]  (value not drawn)  (no BOM)
XBT1  Manufacturer part Number: S8411-45R  [HLDR_S8411-45R]  (hidden comment: BATTERY HOLDER COIN 12MM SMD)

### Blocks framed on the sheet
DRY CONTACTS FOR SWITCH CLOSURE INPUTS: D3 D4 Q7 R10-R13 RE1 TB1 TP11-TP13
USB: D20 J6 TP9 TP10
Coincell BAT: C38 D13 D14 R49 TP4 XBT1
LCD CONTROL INPUTS: J8 R16 R17 TP15 TP16

### Ports
LCD_UART_RX (out), LCD_UART_TX (in), LID_UPDN (in), PLAY_OUT (in), RESET (out), SW_CLK (out), SWD_IO (bidir), SYS_LOCK (in), VBAT

### Nets
+3.3V: D3.2(K) D4.2(K) D13.2(A) D16.1(K) J10.1 R10.2 R11.2 R50.2 R51.2 RE1.1
+5V: D20.1(K) J6.1 TP9.1
DGND: C38.1 D3.1(A) D4.1(A) D16.2(A) D17.2(A) D18.2(A) D19.2(A) D20.2(A) J6.4 J6.5 J6.6 J8.1 J8.2 J8.4 J8.6 J10.3 TB1.3(GND1) TB1.4 TB1.7(GND2) TB1.8 TP10.1 XBT1.2(-)
GND: Q7.2(S)
LCD_UART_RX: R17.2 TP16.1 ; port LCD_UART_RX
LCD_UART_RX-PA10: J8.5 R17.1
LCD_UART_TX: R16.2 TP15.1 ; port LCD_UART_TX
LCD_UART_TX-PA9: J8.3 R16.1
LID_UPDN: D4.3(AK) R13.2 TP13.1 ; port LID_UPDN
PLAY_OUT: Q7.1(G) TP11.1 ; port PLAY_OUT
RESET: D19.1(K) J10.5 ; port RESET
SW_CLK: D17.1(K) J10.2 R50.1 ; port SW_CLK
SWD_IO: D18.1(K) J10.4 R51.1 ; port SWD_IO
SYS_LOCK: D3.3(AK) R12.2 TP12.1 ; port SYS_LOCK
VBAT: C38.2 R49.2 TP4.1 ; port VBAT
NetD13_1: D13.1(K) D14.1(K) R49.1
NetD14_2: D14.2(A) XBT1.1(+)
NetQ7_3: Q7.3(D) RE1.12
NetR10_1: R10.1 R12.1 TB1.5(INPUT2) TB1.6
NetR11_1: R11.1 R13.1 TB1.1(INPUT1) TB1.2
NetRE1_8: RE1.8 TB1.9(OUTPUTN) TB1.10
NetRE1_9: RE1.9 TB1.11(OUTPUTP) TB1.12

Not connected (* = marked no-connect by the designer): J6 2* 3*; J8 7* 8*; RE1 3* 4* 5* 10*

### Notes on the sheet
- JTAG-SWD
- (near D19) OPTIONAL-DNP
- SOMA Project
- 3
- 6
- V1.0
- (in symbol CONN MOD JACK 6P2C R/A UNSHLD) RJ11

### Library data of the parts
C38 = CAP CER 0.1UF 10V X7R 0603: as C9 on sheet 02_SPEAKER & LED STRIPS; Operating Temperature: -55°C ~ 125°C; Reference link: https://www.digikey.com/en/products/detail/w%C3%BCrth-elektronik/885012206020/5453794; Package: 0603 (1608 Metric); Distributor: Digikey; Distributor part Number: 732-7939-1-ND; Type: CAP; Unit Price: $0.10000; Value: 0.1uF; Rating: 10V
D3 D4 = DIODE ARRAY GP 70V 200MA SOT23: Diode Array 1 Pair Series Connection Standard 70V 200mA Surface Mount TO-236-3, SC-59, SOT-23-3; Manufacturer: Taiwan Semiconductor Corporation; Type: Diodes - Rectifiers - Arrays; Operating Temperature: -55°C ~ 150°C; Package: TO-236-3, SC-59, SOT-23-3; Distributor: Digi-key; Reference link: https://www.digikey.in/product-detail/en/taiwan-semiconductor-corporation/BAV99-RFG/BAV99RFGTR-ND/7374190; Distributor part Number: BAV99RFGTR-ND; Unit Price: 2.46926; Rating: 70V 200mA; Part Status: Active
D13 D14 = DIODE SCHOTTKY 30V 200MA SOD123: Manufacturer: Diodes Incorporated; Manufacturer part Number: BAT43W-7-F; Value: 30 V 200mA (DC); Type: Schottky Diode; Rating: 1 V @ 200 mA; Tolerance: NA; Operating Temperature: -55°C ~ 125°C; Package: SOD-123; Reference link: https://www.digikey.com/en/products/detail/diodes-incorporated/BAT43W-7-F/749953; Distributor: Digikey; Distributor part Number: BAT43W-FDICT-ND; Unit Price: $0.50000
D16-D19 = TVS DIODE 3.3VWM 11.5VC SOD923: as D22 on sheet 01_POWER SUPPLY; Operating Temperature: -55°C to +150°C; Distributor: Digikey; Distributor part Number: ESD9B3.3ST5GOSTR-ND; Package: SOD-923; Rating: 3.3V 11.5V; Reference link: https://www.digikey.com/product-detail/en/on-semiconductor/ESD9B3.3ST5G/ESD9B3.3ST5GOSTR-ND/1973669; Type: TVS; Unit Price: $0.24000
D20 = SP1003-01DTG: Manufacturer: Littelfuse Inc.; Value: 12V (Typ) Clamp 7A (8/20µs; Tolerance: NA; Type: IC; Manufacturer Part Number: SP1003-01DTG; Operating Temperature: -40°C ~ 125°C (TJ); Distributor: Mouser; Distributor part Number: 576-SP1003-01DTG; Package: SOD-723-2; Reference link: https://www.mouser.in/ProductDetail/Littelfuse/SP1003-01DTG?qs=Xb8IjHhkxj76JbYOs4IgRA%3D%3D
J6 = CONN RCPT USB2.0 TYPEA 4POS R/A: Manufacturer: TE Connectivity AMP Connectors; Rating: 30VAC, 1A per Contact; Tolerance: NA; Unit Price: $1.68000; Distributor: Digikey; Distributor part Number: A31726-ND; Manufacturer part Number: 292303-1; Reference link: https://www.digikey.com/en/products/detail/te-connectivity-amp-connectors/292303-1/773786; Type: USB-A (USB TYPE A)
J8 = CONN MOD JACK 6P2C R/A UNSHLD: Jack Modular Connector 6p2c (RJ11) 90° Angle (Right) Unshielded Cat3; Manufacturer: TE Connectivity AMP Connectors; Category: Modular Connectors - Jacks; Part Status: Active; Connector Type: Jack; Number of Positions/Contacts: 6p2c (RJ11); Mounting Type: Through Hole; Operating Temperature: -40°C ~ 85°C; Packaging: Tray; Distributor: Digikey; Distributor Part Number: A31404-ND; Reference Link: https://www.digikey.in/product-detail/en/te-connectivity-amp-connectors/5520250-1/A31404-ND/769548; Ratings: Cat3; Unit Price: 111.90000
J10 = CONN HEADER VERT 5POS 2.54MM: Manufacturer: Amphenol ICC (FCI); Rating: UL94 V-0; Tolerance: NA; Unit Price: $0.48000; Distributor: Digikey; Distributor part Number: 609-3462-ND; Manufacturer part Number: 68000-105HLF; Package: Bag; Reference link: https://www.digikey.com/en/products/detail/amphenol-icc-fci/68000-105HLF/2023304; Type: Header
Q7 = MOSFET N-CH 50V 220MA SOT23-3: N-Channel 50V 220mA (Ta) 360mW (Ta) Surface Mount SOT-23-3; Manufacturer: ON Semiconductor; Tolerance: NA; Type: N-Channel MOSFET; Unit Price: 20.89000; Distributor: Digikey; Distributor part Number: BSS138CT-ND; Manufacturer part Number: BSS138; Package: TO-236-3, SC-59, SOT-23-3; Rating: 50V 220mA; Reference link: https://www.digikey.in/product-detail/en/on-semiconductor/BSS138/BSS138CT-ND/244294
R10 R11 = RES SMD 10 OHM 5% 1/16W 0402: as R4 on sheet 02_SPEAKER & LED STRIPS; Tolerance: ±5%; Distributor: Digikey; Package: 0402 (1005 Metric); Operating Temperature: -55°C ~ 155°C; Type: RES; Distributor part Number: 541-10JCT-ND; Reference link: https://www.digikey.com/en/products/detail/vishay-dale/CRCW040210R0JNED/1177520; Unit Price: $0.10000
R12 R13 = RES SMD 1K OHM 1% 1/16W 0402: Manufacturer: Yageo; Manufacturer part Number: AC0402FR-071KL; Rating: 0.063W, 1/16W; Tolerance: ±1%; Distributor: Digikey; Distributor part Number: 311-1KLBCT-ND; Unit Price: $0.10000; Reference link: https://www.digikey.com/en/products/detail/yageo/AC0402FR-071KL/2827801; Type: RES; Package: 0402 (1005 Metric); Part Status: Active; Operating Temperature: -55°C ~ 155°C; Size / Dimension: 0.039" L x 0.020" W (1.00mm x 0.50mm)
R16 R17 = RES SMD 0 OHM JUMPER 1/16W 0402: 0 Ohms Jumper 0.063W, 1/16W Chip Resistor 0402 (1005 Metric) Moisture Resistant Thick Film; Manufacturer: Yageo; Manufacturer part Number: RC0402JR-070RP; Distributor: Digikey; Distributor part Number: YAG1279TR-ND; Unit Price: 0.00377; Reference link: https://www.digikey.sg/product-detail/en/yageo/RC0402JR-070RP/YAG1279TR-ND/4935294; Type: RES; Rating: 0.063W, 1/16W; Package: 0402 (1005 Metric); Tolerance: Jumper; Part Status: Active; Operating Temperature: -55°C ~ 155°C; Size / Dimension: 0.039" L x 0.020" W (1.00mm x 0.50mm)
R49 = RES SMD 100 OHM 1% 1/10W 0402: 100 Ohms ±1% 0.1W, 1/10W Chip Resistor 0402 (1005 Metric) Automotive AEC-Q200 Thick Film; Manufacturer: Panasonic Electronic Components; Manufacturer part Number: ERJ-2RKF1000X; Operating Temperature: -55°C ~ 155°C; Distributor: Digikey; Package: 0402; Type: RES; Distributor part Number: P100LCT-ND; Rating: 1/10W; Reference link: https://www.digikey.in/product-detail/en/panasonic-electronic-components/ERJ-2RKF1000X/P100LCT-ND/194126; Tolerance: ±1%; Value: 100E; Unit Price: 7.46000
R50 R51 = RES SMD 10K OHM 1% 1/10W 0402: 10 kOhms ±1% 0.1W, 1/10W Chip Resistor 0402 (1005 Metric) Automotive AEC-Q200 Thick Film; Manufacturer: Panasonic Electronic Components; Manufacturer part Number: ERJ-2RKF1002X; Operating Temperature: -55°C ~ 155°C; Reference link: https://www.digikey.in/product-detail/en/panasonic-electronic-components/ERJ-2RKF1002X/P10.0KLCT-ND/194119; Distributor: Digikey; Distributor part Number: P10.0KLCT-ND; Package: 0402; Type: RES; Rating: 1/10W; Cost: 0.00715; Tolerance: ±1%; Value: 10K
RE1 = RELAY GEN PURPOSE DPDT 1A 3VDC: General Purpose Relay DPDT (2 Form C) Surface Mount; Manufacturer: Panasonic Electric Works; Manufacturer Part Number: TXS2SA-3V; Rating: 3VDC 1A; Coil Resistance: 180 Ohms; Distributor: Digikey; Distributor Part Number: 255-2341-5-ND; Unit Price: $4.65000; Packaging: Tube; Operating Temperature: -40°C ~ 70°C; Type: Signal Relays, Up to 2 Amps; Reference Link: https://www.digikey.com/en/products/detail/panasonic-electric-works/TXS2SA-3V/650160
TB1 = TERM BLK 6P SIDE ENT 5.08MM PCB: 6 Position Wire to Board Terminal Block Horizontal with Board 0.200" (5.08mm) Through Hole; Manufacturer: TE Connectivity AMP Connectors; Wire Gauge: 12 AWG; Rating: 300V  15A; Category: Terminal Blocks - Wire to Board; Package: Tray; Part Status: Active; Mounting Type: Through Hole; Operating Temperature: -40°C ~ 110°C; Distributor: Digikey; Distributor Part Number: A120496-ND; Unit Price: 349.87000
XBT1 = BATTERY HOLDER COIN 12MM SMD: Manufacturer: Harwin Inc.; Distributor: Digikey; Distributor part Number: 952-1745-1-ND; Unit Price: $1.39000; Reference link: https://www.digikey.com/en/products/detail/harwin-inc/S8411-45R/3131055; Type: Coin Cell, Holder; Package: Cut Tape (CT; Part Status: Active; Operating Temperature: -55°C ~ 105°C
TP4 TP9-TP13 TP15 TP16 = Test Point,1.6mm Diameter,SMD: AEMCI Part Number: *; Vendor: *; Vendor ID: *